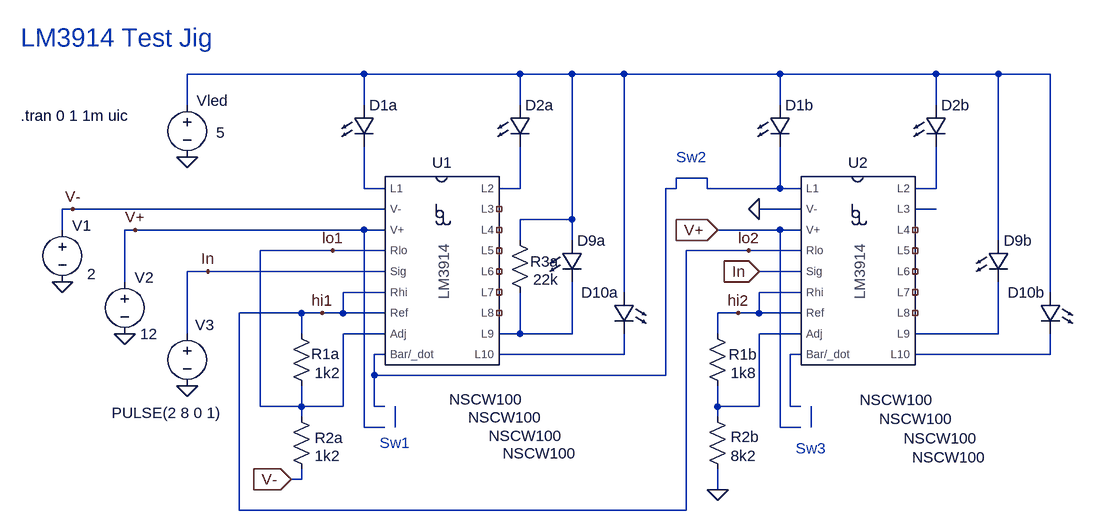
[diagram p0: schematic LM3914_Test.asc]
LM3914_Test.asc, the LTspice schematic file:
Version 4.1
SHEET 1 1496 692
WIRE 240 -112 -32 -112
WIRE 480 -112 240 -112
WIRE 560 -112 480 -112
WIRE 640 -112 560 -112
WIRE 880 -112 640 -112
WIRE 1120 -112 880 -112
WIRE 1216 -112 1120 -112
WIRE 1296 -112 1216 -112
WIRE -32 -64 -32 -112
WIRE 240 -64 240 -112
WIRE 480 -64 480 -112
WIRE 880 -64 880 -112
WIRE 1120 -64 1120 -112
WIRE 768 48 720 48
WIRE 240 64 240 0
WIRE 272 64 240 64
WIRE 480 64 480 0
WIRE 480 64 448 64
WIRE 720 64 720 48
WIRE 720 64 704 64
WIRE 768 64 768 48
WIRE 880 64 880 0
WIRE 880 64 768 64
WIRE 912 64 880 64
WIRE 1120 64 1120 0
WIRE 1120 64 1088 64
WIRE -208 96 -224 96
WIRE 272 96 -208 96
WIRE 912 96 848 96
WIRE 1120 96 1088 96
WIRE 560 112 560 -112
WIRE 560 112 480 112
WIRE -224 128 -224 96
WIRE -112 128 -128 128
WIRE 240 128 -112 128
WIRE 272 128 240 128
WIRE 880 128 784 128
WIRE 912 128 880 128
WIRE 480 144 480 112
WIRE 560 144 560 112
WIRE 1216 144 1216 -112
WIRE 192 160 80 160
WIRE 272 160 192 160
WIRE 832 160 736 160
WIRE 912 160 832 160
WIRE 0 192 -32 192
WIRE 272 192 0 192
WIRE 912 192 848 192
WIRE -128 208 -128 128
WIRE 272 224 208 224
WIRE 640 224 640 -112
WIRE 912 224 848 224
WIRE 1296 224 1296 -112
WIRE 144 256 48 256
WIRE 176 256 144 256
WIRE 208 256 208 224
WIRE 208 256 176 256
WIRE 272 256 208 256
WIRE 816 256 784 256
WIRE 848 256 848 224
WIRE 848 256 816 256
WIRE 912 256 848 256
WIRE -32 288 -32 192
WIRE 144 288 144 256
WIRE 272 288 208 288
WIRE 480 288 480 224
WIRE 480 288 448 288
WIRE 560 288 560 208
WIRE 560 288 480 288
WIRE 784 288 784 256
WIRE 912 288 848 288
WIRE 1216 288 1216 208
WIRE 1216 288 1088 288
WIRE 272 320 256 320
WIRE 640 320 640 288
WIRE 640 320 448 320
WIRE 912 320 896 320
WIRE 1296 320 1296 288
WIRE 1296 320 1088 320
WIRE 256 352 256 320
WIRE 704 352 704 64
WIRE 704 352 256 352
WIRE 80 400 80 160
WIRE 144 400 144 368
WIRE 144 400 80 400
WIRE 208 400 208 288
WIRE 208 400 144 400
WIRE 256 400 256 352
WIRE 272 400 256 400
WIRE 784 400 784 368
WIRE 848 400 848 288
WIRE 848 400 784 400
WIRE 896 400 896 320
WIRE 912 400 896 400
WIRE 144 416 144 400
WIRE 784 416 784 400
WIRE 240 432 240 128
WIRE 272 432 240 432
WIRE 288 432 288 400
WIRE 880 432 880 128
WIRE 912 432 880 432
WIRE 928 432 928 400
WIRE 144 512 144 496
WIRE 144 512 128 512
WIRE 784 528 784 496
WIRE 48 560 48 256
WIRE 736 560 736 160
WIRE 736 560 48 560
FLAG -128 288 0
FLAG -32 368 0
FLAG 0 192 In
FLAG 176 256 hi1
FLAG 192 160 lo1
FLAG -224 208 0
FLAG -112 128 V+
FLAG 848 192 In
IOPIN 848 192 In
FLAG 816 256 hi2
FLAG -208 96 V-
FLAG 128 512 V-
IOPIN 128 512 In
FLAG 832 160 lo2
FLAG 848 96 0
FLAG 784 528 0
FLAG -32 16 0
FLAG 784 128 V+
IOPIN 784 128 In
SYMBOL voltage -128 192 R0
WINDOW 123 0 0 Left 2
WINDOW 39 0 0 Left 2
WINDOW 0 15 9 Left 2
SYMATTR InstName V2
SYMATTR Value 12
SYMBOL voltage -32 272 R0
WINDOW 3 -116 138 Left 2
WINDOW 123 0 0 Left 2
WINDOW 39 0 0 Left 2
WINDOW 0 12 2 Left 2
SYMATTR Value PULSE(2 8 0 1)
SYMATTR InstName V3
SYMBOL res 128 272 R0
WINDOW 0 31 47 Left 2
SYMATTR InstName R1a
SYMATTR Value 1k2
SYMBOL res 128 400 R0
WINDOW 0 36 48 Left 2
SYMATTR InstName R2a
SYMATTR Value 1k2
SYMBOL LED 224 -64 R0
WINDOW 3 147 453 Left 2
SYMATTR Value NSCW100
SYMATTR InstName D1a
SYMATTR Description Diode
SYMATTR Type diode
SYMBOL LED 464 -64 R0
WINDOW 3 -64 481 Left 2
SYMATTR Value NSCW100
SYMATTR InstName D2a
SYMATTR Description Diode
SYMATTR Type diode
SYMBOL LED 656 224 M0
WINDOW 3 89 248 Left 2
SYMATTR Value NSCW100
SYMATTR InstName D10a
SYMATTR Description Diode
SYMATTR Type diode
SYMBOL voltage -224 112 R0
WINDOW 123 0 0 Left 2
WINDOW 39 0 0 Left 2
WINDOW 0 15 9 Left 2
WINDOW 3 38 84 Left 2
SYMATTR InstName V1
SYMATTR Value 2
SYMBOL res 464 128 R0
WINDOW 0 32 49 Left 2
SYMATTR InstName R3a
SYMATTR Value 22k
SYMBOL LED 544 144 R0
WINDOW 3 -112 301 Left 2
SYMATTR Value NSCW100
SYMATTR InstName D9a
SYMATTR Description Diode
SYMATTR Type diode
SYMBOL LED 864 -64 R0
WINDOW 3 139 454 Left 2
SYMATTR Value NSCW100
SYMATTR InstName D1b
SYMATTR Description Diode
SYMATTR Type diode
SYMBOL LED 1104 -64 R0
WINDOW 3 -71 483 Left 2
SYMATTR Value NSCW100
SYMATTR InstName D2b
SYMATTR Description Diode
SYMATTR Type diode
SYMBOL res 768 272 R0
WINDOW 0 33 48 Left 2
SYMATTR InstName R1b
SYMATTR Value 1k8
SYMBOL res 768 400 R0
WINDOW 0 36 47 Left 2
SYMATTR InstName R2b
SYMATTR Value 8k2
SYMBOL LED 1312 224 M0
WINDOW 3 115 254 Left 2
SYMATTR Value NSCW100
SYMATTR InstName D10b
SYMATTR Description Diode
SYMATTR Type diode
SYMBOL LED 1200 144 R0
WINDOW 3 -130 305 Left 2
SYMATTR Value NSCW100
SYMATTR InstName D9b
SYMATTR Description Diode
SYMATTR Type diode
SYMBOL voltage -32 -80 R0
WINDOW 123 0 0 Left 2
WINDOW 39 0 0 Left 2
WINDOW 0 15 9 Left 2
WINDOW 3 45 58 Left 2
SYMATTR InstName Vled
SYMATTR Value 5
SYMBOL LM3914 352 256 R0
SYMATTR InstName U1
SYMBOL LM3914 992 256 R0
SYMATTR InstName U2
TEXT -288 -48 Left 2 !.tran 0 1 1m uic
TEXT -288 -168 Left 4 ;LM3914 Test Jig
TEXT 264 456 Left 2 ;Sw1
TEXT 720 16 Left 2 ;Sw2
TEXT 904 464 Left 2 ;Sw3

The netlist it stands for:
* LM3914_Test.asc
V2 V+ 0 12
V3 In 0 PULSE(2 8 0 1)
R1a lo2 lo1 1k2
R2a lo1 V- 1k2
D1a N001 N003 NSCW100
D2a N001 N004 NSCW100
D10a N001 N010 NSCW100
V1 V- 0 2
R3a N001 N007 22k
D9a N001 N007 NSCW100
D1b N001 N002 NSCW100
D2b N001 N005 NSCW100
R1b hi2 N008 1k8
R2b N008 0 8k2
D10b N001 N012 NSCW100
D9b N001 N009 NSCW100
Vled N001 0 5
X§U1 N002 In lo2 V+ V- lo1 N003 N010 N004 NC_01 NC_02 NC_03 NC_04 NC_05 NC_06 N007 lo2 lo1 LM3914  ; pins Bar/_dot Sig Rhi V+ V- Adj L1 L10 L2 L3 L4 L5 L6 L7 L8 L9 Ref Rlo
X§U2 N011 In hi2 V+ 0 N008 N002 N012 N005 N006 NC_07 NC_08 NC_09 NC_10 NC_11 N009 hi2 lo2 LM3914  ; pins Bar/_dot Sig Rhi V+ V- Adj L1 L10 L2 L3 L4 L5 L6 L7 L8 L9 Ref Rlo
.model D D
.lib standard.dio
.tran 0 1 1m uic
* LM3914 Test Jig
* Sw1
* Sw2
* Sw3
.lib LM3914.sub
.backanno
.end